# Altium schematic sheet Fri3D_IRA_Power.SchDoc: Power
size A3; Date: 25/03/2024; DrawnBy: Wim Van Gool; DocumentNumber: 4; Revision: 02; SheetNumber: 4; SheetTotal: 4
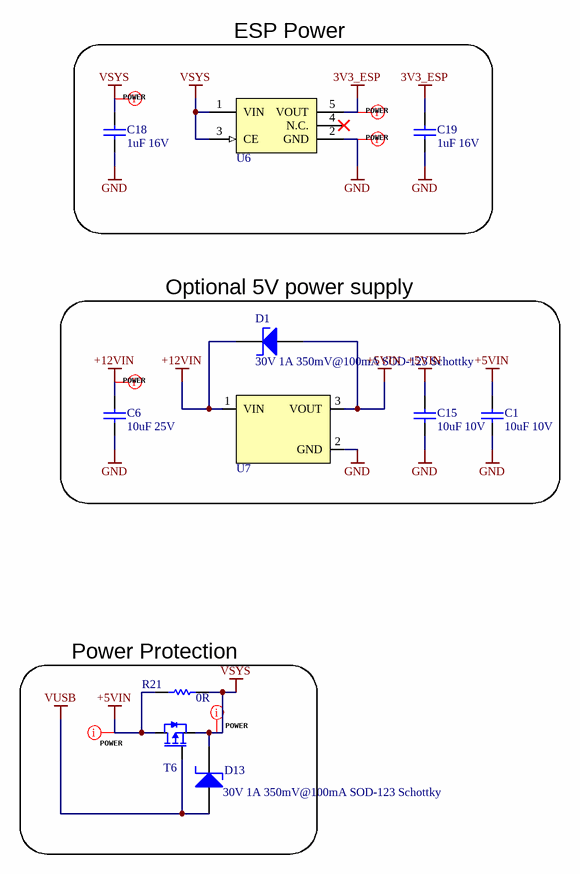
[diagram p0: Fri3D_IRA_Power.SchDoc]

## Parts
C1  value 10uF 10V  [C0805_N]  (hidden comment: CAP_CERAMIC)
C6  value 10uF 25V  [C0805_N]
C15  value 10uF 10V  [C0805_N]  (hidden comment: CAP_CERAMIC)
C18  value 1uF 16V  [C0603_N]
C19  value 1uF 16V  [C0603_N]
D1  30V 1A 350mV@100mA SOD-123 Schottky  [ON_SOD-123FL_AC]
D13  30V 1A 350mV@100mA SOD-123 Schottky  [ON_SOD-123FL_AC]
R21  value 0R  [R0603_N]
T6  -2.3A -20V P-Ch MOSFET Vgs -1V  [SOT23-3]  (value not drawn)
U6  3V3 LDO 700mA 50mV  [SOT23-5]  (value not drawn)
U7  Mornsun K7805-500R3-LB 5V 500mA 4.75~36Vin  [K78xx-500R3-LB]  (value not drawn)

## Blocks framed on the sheet
ESP Power: C18 C19 U6
Optional 5V power supply: C1 C6 C15 D1 U7
Power Protection: D13 R21 T6

## Nets
3V3_ESP: C19.1 U6.5(VOUT)
+5VIN: C1.1 C15.1 D1.A R21.2 T6.3(D) U7.3(VOUT)
+12VIN: C6.1 D1.C U7.1(VIN)
GND: C1.2 C6.2 C15.2 C18.2 C19.2 U6.2(GND) U7.2(GND)
VSYS: C18.1 D13.C R21.1 T6.2(S) U6.1(VIN) U6.3(CE)
VUSB: D13.A T6.1(G)

Not connected (* = marked no-connect by the designer): U6 4(N.C.)*

## Layout directives
net class POWER: 3V3_ESP, +5VIN, +12VIN, GND, VSYS

## Notes on the sheet
- Title
- Revision
- Date
- Dranw By
- Size
- A3
- Sheet
- of

## Library data of the parts
C1 C15 = CAP # 10uF 10V 0805: Capacitor Ceramic; Supplier 1: Farnell; Supplier Part Number 1: 2320859; Supplier 3: Generic; Supplier Part Number 3: 10uF 10V 0805 X7R; Description: CAP # 10uF 10V 0805; Supplier 2: LCSC; Supplier Part Number 2: C17024
C6 = CAP # 10uF 25V 0805: Capacitor Ceramic; Supplier 1: LCSC; Supplier Part Number 1: C237493; Supplier 3: Generic; Supplier Part Number 3: 10uF 25V 0805 X7R
C18 C19 = CAP # 1uF 16V 0603: Capacitor Ceramic; Supplier 1: Farnell; Supplier Part Number 1: 2320814; Supplier 2: LCSC; Supplier 3: Generic; Supplier Part Number 2: C1592; Supplier Part Number 3: 1uF 16V 0603 X7R
D1 D13 = Schottky # LMBR130T1G: =Description; Supplier 1: LCSC; Supplier Part Number 1: C48974; Value: LMBR130T1G; Description: Schottky # LMBR130T1G; Supplier 2: LCSC; Supplier Part Number 2: C917121
R21 = RES # 0R 0603: Supplier 1: Farnell; Supplier Part Number 1: 2447743; Supplier 3: Generic; Supplier Part Number 3: 0R 1% 0603; Supplier 2: LCSC; Supplier Part Number 2: C95177 / C15402
T6 = SL2301 P-Ch MOSFET -2.3A -20Vds: =Description; Value: SL2301; Supplier 1: LCSC; Supplier Part Number 1: C181086
U6 = LDO # 3V3 XC6210B33: =Designator; Value: XC6210B332MR; Supplier 1: Farnell; Supplier Part Number 1: 1057803; Supplier 2: LCSC; Supplier Part Number 2: C47719
U7 = PWR MOD Buck 5V K7805-500R3-LB: =Designator; Value: K7805-500R3-LB; Supplier 1: Digi-key; Supplier Part Number 1: 2725-K7805-500R3-LB-ND; Supplier 2: LCSC; Supplier Part Number 2: C5198056